# Altium schematic sheet Res 10K 805.schdoc
size 127 x 99 mm
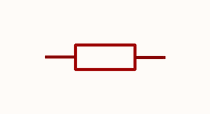
[diagram p0: Res 10K 805.schdoc]

## Parts
R?  10kΩ  [R0805]  (value not drawn)

## Nets

Not connected (* = marked no-connect by the designer): R? 1 2

## Library data of the parts
R? = ERJPB6B1002V: Manufacturer: PANASONIC(松下); Add into BOM: yes; Tolerance: ±0.1%; Temperature Coefficient: ±50ppm/℃; Symbol: ERJPB6B1002V; Device: ERJPB6B1002V; LCSC Part Name: 10kΩ ±0.1% 200mW 厚膜电阻; Supplier Part: C161788; Manufacturer Part: ERJPB6B1002V; Supplier Footprint: 0805; JLCPCB Part Class: Extended Part; Datasheet: https://atta.szlcsc.com/upload/public/pdf/source/20180416/C191317_151B7FE0B8A326015C369A5828110A93.pdf; Supplier: LCSC; Convert to PCB: yes; Type: Thick Film Resistors; Value: 10kΩ; Operating Temperature Range: -55℃~+155℃